# EAGLE design SparkFun GPS RTK Surveyor - Enclosure (EAGLE 9.5.2)

## Sheet 1 of 2
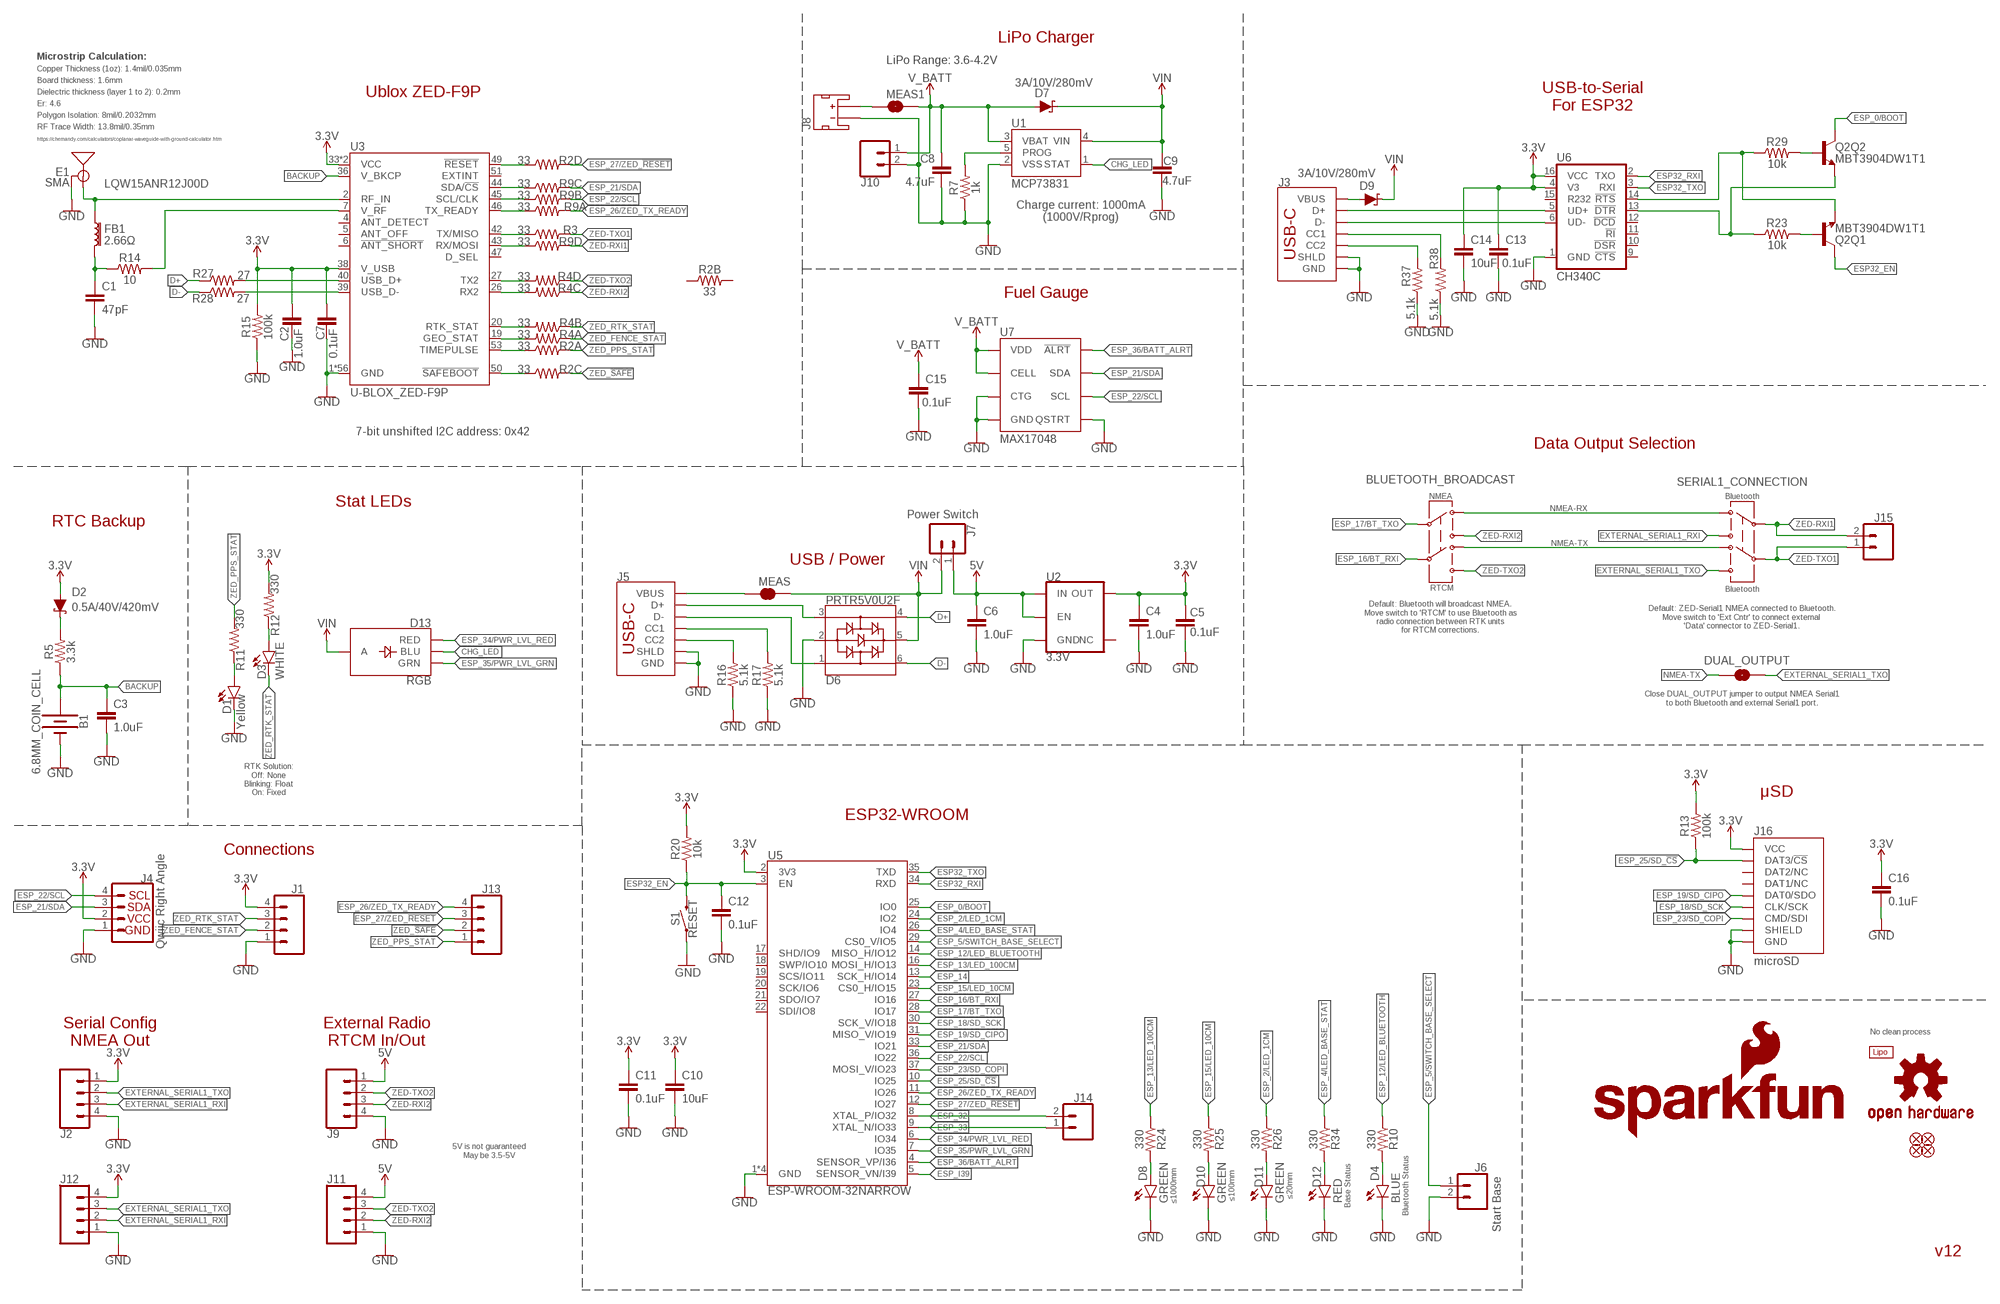
[diagram p0: schematic, sheet 1]

### Parts
B1  6.8MM_COIN_CELL  ML414H_IV01E_BATTERY  [ML414H_IV01E]
BLUETOOTH_BROADCAST  SWITCH-DPDT-SMD-AYZ0202  [SWITCH_DPDT_SMD_AYZ0202]
BT1  LIPO-OUTLINE1100  [LIPO-1000]
C1  47pF  47PF-0402-25V-5%-X7R  [0402]
C2  1.0uF  1.0UF-0603-16V-10%-X7R  [0603]
C3  1.0uF  1.0UF-0603-16V-10%-X7R  [0603]
C4  1.0uF  1.0UF-0603-16V-10%-X7R  [0603]
C5  0.1uF  0.1UF-0603-25V-5%  [0603]
C6  1.0uF  1.0UF-0603-16V-10%-X7R  [0603]
C7  0.1uF  0.1UF-0603-25V-5%  [0603]
C8  4.7uF  4.7UF-0603-35V-(20%)  [0603]
C9  4.7uF  4.7UF-0603-35V-(20%)  [0603]
C10  10uF  10UF-0603-6.3V-20%  [0603]
C11  0.1uF  0.1UF-0603-25V-(+80/-20%)  [0603]
C12  0.1uF  0.1UF-0603-25V-(+80/-20%)  [0603]
C13  0.1uF  0.1UF-0603-25V-(+80/-20%)  [0603]
C14  10uF  10UF-0603-6.3V-20%  [0603]
C15  0.1uF  0.1UF-0603-25V-(+80/-20%)  [0603]
C16  0.1uF  0.1UF-0603-25V-(+80/-20%)  [0603]
D1  Yellow  LED-YELLOW0603  [LED-0603]
D2  0.5A/40V/420mV  DIODE-SCHOTTKY-PMEG4005EJ  [SOD-323]
D3  WHITE  LED-WHITE0603  [LED-0603]
D4  BLUE  LED-BLUE0603  [LED-0603]
D6  PRTR5V0U2F  [SOT886]
D7  3A/10V/280mV  DIODE-SCHOTTKY-BAT60A  [SOD-323]
D8  GREEN  LED-GREEN0603  [LED-0603]
D9  3A/10V/280mV  DIODE-SCHOTTKY-BAT60A  [SOD-323]
D10  GREEN  LED-GREEN0603  [LED-0603]
D11  GREEN  LED-GREEN0603  [LED-0603]
D12  RED  LED-RED0603  [LED-0603]
D13  RGB  LED-RGB-CAPLCC  [P-LCC-4-3]
DUAL_OUTPUT  JUMPER-SMT_2_NO_SILK  [SMT-JUMPER_2_NO_SILK]
E1  SMA  ANTENNA-GROUNDEDEDGE_SMA_SMD  [SMA-EDGE-SMD]
FB1  2.66Ω  FERRITE_BEAD-0402-2.66OHM-1GHZ  [0402-TIGHT]
J1  CONN_041X04_NO_SILK_NO_POP  [1X04_NO_SILK]
J2  CONN_04JST-SMD-LOCKING  [JST-4-SMD-1.25MM-LOCKING]
J3  USB-C  USB_C_2-LAYER_PADS  [USB-C-16P-2LAYER-PADS]
J4  Qwiic Right Angle  I2C_STANDARDQWIIC  [JST04_1MM_RA]
J5  USB_C_2-LAYER_PADS  [USB-C-16P-2LAYER-PADS]
J6  Start Base  CONN_02-JST-2MM-SMT  [JST-2-SMD]
J7  Power Switch  CONN_02-JST-2MM-SMT  [JST-2-SMD]
J8  JST_2MM_MALE  [JST-2-SMD]
J9  CONN_04JST-SMD-LOCKING  [JST-4-SMD-1.25MM-LOCKING]
J10  CONN_021X02_NO_SILK  [1X02_NO_SILK]
J11  CONN_041X04_NO_SILK_NO_POP  [1X04_NO_SILK]
J12  CONN_041X04_NO_SILK_NO_POP  [1X04_NO_SILK]
J13  CONN_041X04_NO_SILK_NO_POP  [1X04_NO_SILK]
J14  CONN_021X02_NO_SILK  [1X02_NO_SILK]
J15  CONN_021X02_NO_SILK  [1X02_NO_SILK]
J16  microSD  MICRO-SD-SDIOPUSH-PUSH  [MICRO-SD-SOCKET]
JP21  FIDUCIALUFIDUCIAL  [FIDUCIAL-MICRO]
JP61  FIDUCIALUFIDUCIAL  [FIDUCIAL-MICRO]
JP71  FIDUCIALUFIDUCIAL  [FIDUCIAL-MICRO]
JP81  FIDUCIALUFIDUCIAL  [FIDUCIAL-MICRO]
LOGO1  OSHW-LOGOMINI  [OSHW-LOGO-MINI]
LOGO2  SFE_LOGO_NAME_FLAME.1_INCH  [SFE_LOGO_NAME_FLAME_.1]
MEAS  JUMPER-COMBO_2_NC_TRACE  [COMBO-JUMPER_2_NC_TRACE]
MEAS1  JUMPER-COMBO_2_NC_TRACE  [COMBO-JUMPER_2_NC_TRACE]
Q2  MBT3904DW1T1  TRANS_NPN_DUAL-MBT3904DW1T1  [SC70-6]
R2  33  33OHM_RA-1206-1/16W-5%  [1206_RA]
R3  33  33OHM-0603-1/10W-1%  [0603]
R4  33  33OHM_RA-1206-1/16W-5%  [1206_RA]
R5  3.3k  3.3KOHM-0603-1/10W-1%  [0603]
R7  1k  1KOHM-0603-1/10W-1%  [0603]
R9  33  33OHM_RA-1206-1/16W-5%  [1206_RA]
R10  330  330OHM-0603-1/10W-1%  [0603]
R11  330  330OHM-0603-1/10W-1%  [0603]
R12  330  330OHM-0603-1/10W-1%  [0603]
R13  100k  100KOHM-0603-1/10W-1%  [0603]
R14  10  10OHM-0603-1/10W-1%  [0603]
R15  100k  100KOHM-0603-1/10W-1%  [0603]
R16  5.1k  5.1KOHM5.1KOHM-0603-1/10W-1%  [0603]
R17  5.1k  5.1KOHM5.1KOHM-0603-1/10W-1%  [0603]
R20  10k  10KOHM-0603-1/10W-1%  [0603]
R23  10k  10KOHM-0603-1/10W-1%  [0603]
R24  330  330OHM-0603-1/10W-1%  [0603]
R25  330  330OHM-0603-1/10W-1%  [0603]
R26  330  330OHM-0603-1/10W-1%  [0603]
R27  27  27OHM-0603-1/10W-1%  [0603]
R28  27  27OHM-0603-1/10W-1%  [0603]
R29  10k  10KOHM-0603-1/10W-1%  [0603]
R34  330  330OHM-0603-1/10W-1%  [0603]
R37  5.1k  5.1KOHM5.1KOHM-0603-1/10W-1%  [0603]
R38  5.1k  5.1KOHM5.1KOHM-0603-1/10W-1%  [0603]
S1  RESET  MOMENTARY-SWITCH-SPST-SMD-5.2-TALL-REDUNDANT  [TACTILE_SWITCH_SMD_5.2MM]
SERIAL1_CONNECTION  SWITCH-DPDT-SMD-AYZ0202  [SWITCH_DPDT_SMD_AYZ0202]
U1  MCP73831  [SOT23-5]
U2  3.3V  V_REG_AP2112K-3.3V  [SOT23-5]
U3  U-BLOX_ZED-F9P  [ZED-F9P]
U5  ESP-WROOM-32NARROW  [ESP-WROOM-32-NARROW]
U6  CH340C  [SO016]
U7  MAX17048  MAX17048DFN8  [DFN-8]

### Nets
3.3V [power]: C2.1 C4.1 C5.2 C7.2 C10.1 C11.1 C13.1 C14.1 C16.1 D2.A J1.4 J2.1 J4.2 J12.4 J16.VCC R12.2 R13.2 R15.2 R20.2 U2.5(OUT) U3.33(VCC) U3.34(VCC) U3.38(V_USB) U5.2(3V3) U6.4(V3) U6.16(VCC)
5V [power]: C6.1 J7.1 J9.1 J11.4 U2.1(IN) U2.3(EN)
ANT_VCC: C1.1 FB1.2 R14.1
BACKUP: B1.+ C3.1 R5.1 U3.36(V_BKCP)
CC1: J5.A5(CC1) R17.2
CC2: J5.B5(CC2) R16.2
CC3: J3.B5(CC2) R37.2
CC4: J3.A5(CC1) R38.2
CHG_LED: D13.3(BLU) U1.1(STAT)
D+: D6.4 R27.1
D+1: J3.A6(D+) J3.B6(D+) U6.5(UD+)
D-: D6.6 R28.1
D-1: J3.A7(D-) J3.B7(D-) U6.6(UD-)
ESP32_!DTR: Q2.1(Q2:E) R23.1 U6.13(!DTR)
ESP32_!RTS: Q2.4(Q1:E) R29.1 U6.14(!RTS)
ESP32_EN: C12.1 Q2.3(Q1:C) R20.1 S1.3 S1.4 U5.3(EN)
ESP32_RXI: U5.34(RXD) U6.2(TXO)
ESP32_TXO: U5.35(TXD) U6.3(RXI)
ESP_0/BOOT: Q2.6(Q2:C) U5.25(IO0)
ESP_2/LED_1CM: R26.1 U5.24(IO2)
ESP_4/LED_BASE_STAT: R34.1 U5.26(IO4)
ESP_5/SWITCH_BASE_SELECT: J6.1 U5.29(CS0_V/IO5)
ESP_12/LED_BLUETOOTH: R10.1 U5.14(MISO_H/IO12)
ESP_13/LED_100CM: R24.1 U5.16(MOSI_H/IO13)
ESP_14: U5.13(SCK_H/IO14)
ESP_15/LED_10CM: R25.1 U5.23(CS0_H/IO15)
ESP_16/BT_RXI: BLUETOOTH_BROADCAST.5 U5.27(IO16)
ESP_17/BT_TXO: BLUETOOTH_BROADCAST.2 U5.28(IO17)
ESP_18/SD_SCK: J16.SCLK(CLK/SCK) U5.30(SCK_V/IO18)
ESP_19/SD_CIPO: J16.DO/DAT0(DAT0/SDO) U5.31(MISO_V/IO19)
ESP_21/SDA: J4.3 R9.P6 U5.33(IO21) U7.8(SDA)
ESP_22/SCL: J4.4 R9.P7 U5.36(IO22) U7.7(SCL)
ESP_23/SD_COPI: J16.DI/CMD(CMD/SDI) U5.37(MOSI_V/IO23)
ESP_25/SD_!CS!: J16.CS/DAT3(DAT3/!CS!) R13.1 U5.10(IO25)
ESP_26/ZED_TX_READY: J13.4 R9.P8 U5.11(IO26)
ESP_27/ZED_!RESET!: J13.3 R2.P5 U5.12(IO27)
ESP_32: J14.2 U5.8(XTAL_P/IO32)
ESP_33: J14.1 U5.9(XTAL_N/IO33)
ESP_34/PWR_LVL_RED: D13.1(RED) U5.6(IO34)
ESP_35/PWR_LVL_GRN: D13.2(GRN) U5.7(IO35)
ESP_36/BATT_ALRT: U5.4(SENSOR_VP/I36) U7.5(!ALRT)
ESP_I39: U5.5(SENSOR_VN/I39)
EXTERNAL_SERIAL1_RXI: J2.3 J12.2 SERIAL1_CONNECTION.3
EXTERNAL_SERIAL1_TXO: DUAL_OUTPUT.2 J2.2 J12.3 SERIAL1_CONNECTION.6
FENCE_LV: R4.P8 U3.19(GEO_STAT)
GND: B1.- C1.2 C2.2 C3.2 C4.2 C5.1 C6.2 C7.1 C8.2 C9.2 C10.2 C11.2 C12.2 C13.2 C14.2 C15.2 C16.2 D1.C D4.C D6.2 D8.C D10.C D11.C D12.C E1.GND@0(GND) E1.GND@1(GND) J1.1 J2.4 J3.GND J3.GND2(GND) J3.SHLD1(SHLD) J3.SHLD2(SHLD) J3.SHLD3(SHLD) J3.SHLD4(SHLD) J4.1 J5.GND J5.GND2(GND) J5.SHLD1(SHLD) J5.SHLD2(SHLD) J5.SHLD3(SHLD) J5.SHLD4(SHLD) J6.2 J8.1(-) J9.4 J10.2 J11.1 J12.1 J16.CD1(SHIELD) J16.GND J16.GND1(GND) J16.GND3(GND) R7.1 R15.1 R16.1 R17.1 R37.1 R38.1 S1.1 S1.2 U1.2(VSS) U2.2(GND) U3.1(GND) U3.3(GND) U3.12(GND) U3.14(GND) U3.32(GND) U3.37(GND) U3.41(GND) U3.48(GND) U3.55(GND) U3.56(GND) U3.57(GND) U3.58(GND) U3.59(GND) U3.60(GND) U3.61(GND) U3.62(GND) U3.63(GND) U3.64(GND) U3.65(GND) U3.66(GND) U3.67(GND) U3.68(GND) U3.69(GND) U3.70(GND) U3.71(GND) U3.72(GND) U3.73(GND) U3.74(GND) U3.75(GND) U3.76(GND) U3.77(GND) U3.78(GND) U3.79(GND) U3.80(GND) U3.81(GND) U3.82(GND) U3.83(GND) U3.84(GND) U3.85(GND) U3.86(GND) U3.87(GND) U3.88(GND) U3.89(GND) U3.90(GND) U3.91(GND) U3.92(GND) U3.93(GND) U3.94(GND) U3.95(GND) U3.96(GND) U3.97(GND) U3.98(GND) U3.99(GND) U3.100(GND) U3.101(GND) U3.102(GND) U5.1(GND) U5.15(GND) U5.38(GND) U5.GND U6.1(GND) U7.1(CTG) U7.4(GND) U7.6(QSTRT) U7.9(GND)
GPS_ANT1 [RF]: E1.SIG(SIGNAL) FB1.1 U3.2(RF_IN)
N$1: D3.A R12.1
N$2: D1.A R11.1
N$3: D4.A R10.2
N$4 [power]: J5.VBUS1(VBUS) J5.VBUS2(VBUS) MEAS.1 MEAS.3
N$5: R7.2 U1.5(PROG)
N$6: D2.C R5.2
N$7: J8.2(+) MEAS1.1 MEAS1.3
N$11: R27.2 U3.40(USB_D+)
N$12: R28.2 U3.39(USB_D-)
N$13: R14.2 U3.7(V_RF)
N$16: R2.P4 U3.49(!RESET!)
N$18: R2.P3 U3.50(!SAFEBOOT!)
N$22: R9.P1 U3.46(TX_READY)
N$24: Q2.5(Q1:B) R23.2
N$25: Q2.2(Q2:B) R29.2
N$26: D8.A R24.2
N$27: D10.A R25.2
N$29: D11.A R26.2
N$30: D12.A R34.2
N$32 [power]: D9.A J3.VBUS1(VBUS) J3.VBUS2(VBUS)
NMEA-RX: BLUETOOTH_BROADCAST.1 SERIAL1_CONNECTION.1
NMEA-TX: BLUETOOTH_BROADCAST.4 DUAL_OUTPUT.1 SERIAL1_CONNECTION.4
PPS: R2.P1 U3.53(TIMEPULSE)
RTK_LV: R4.P7 U3.20(RTK_STAT)
RX2_LV: R4.P6 U3.26(RX2)
RXLV: R9.P4 U3.43(RX/MOSI)
SCL_LV: R9.P2 U3.45(SCL/CLK)
SDA_LV: R9.P3 U3.44(SDA/!CS!)
TX2_LV: R4.P5 U3.27(TX2)
TXLV: R3.1 U3.42(TX/MISO)
UNP_D+: D6.3 J5.A6(D+) J5.B6(D+)
UNP_D-: D6.1 J5.A7(D-) J5.B7(D-)
V_BATT [power]: C8.1 C15.1 D7.A J10.1 MEAS1.2 MEAS1.4 U1.3(VBAT) U7.2(CELL) U7.3(VDD)
VIN [power]: C9.1 D6.5 D7.C D9.C D13.4(A) J7.2 MEAS.2 MEAS.4 U1.4(VIN)
ZED-RXI1: J15.2 R9.P5 SERIAL1_CONNECTION.2
ZED-RXI2: BLUETOOTH_BROADCAST.3 J9.3 J11.2 R4.P3
ZED-TXO1: J15.1 R3.2 SERIAL1_CONNECTION.5
ZED-TXO2: BLUETOOTH_BROADCAST.6 J9.2 J11.3 R4.P4
ZED_!SAFE!: J13.2 R2.P6
ZED_FENCE_STAT: J1.2 R4.P1
ZED_PPS_STAT: J13.1 R2.P8 R11.2
ZED_RTK_STAT: D3.C J1.3 R4.P2
Unconnected: J8.NC1(PAD1) J8.NC2(PAD2) J16.DAT1(DAT1/NC) J16.DAT2(DAT2/NC) R2.P2 R2.P7 U2.4(NC) U3.4(ANT_DETECT) U3.5(ANT_OFF) U3.6(!ANT_SHORT!) U3.47(D_SEL) U3.51(EXTINT) U5.17(SHD/IO9) U5.18(SWP/IO10) U5.19(SCS/IO11) U5.20(SCK/IO6) U5.21(SDO/IO7) U5.22(SDI/IO8) U6.9(!CTS) U6.10(!DSR) U6.11(!RI) U6.12(!DCD) U6.15(R232)

### Notes on the sheet
- LiPo Charger
- Microstrip Calculation: | LiPo Range: 3.6-4.2V
- Copper Thickness (1oz): 1.4mil/0.035mm
- Board thickness: 1.6mm
- Ublox ZED-F9P
- Dielectric thickness (layer 1 to 2): 0.2mm
- USB-to-Serial
  For ESP32
- Er: 4.6
- Polygon Isolation: 8mil/0.2032mm
- RF Trace Width: 13.8mil/0.35mm
- https://chemandy.com/calculators/coplanar-waveguide-with-ground-calculator.htm
- LQW15ANR12J00D
- Charge current: 1000mA
  (1000V/Rprog)
- Fuel Gauge
- 7-bit unshifted I2C address: 0x42
- Data Output Selection
- NMEA | Bluetooth
- Stat LEDs
- RTC Backup
- USB / Power
- RTCM | Bluetooth
- Default: Bluetooth will broadcast NMEA.
  Move switch to 'RTCM' to use Bluetooth as
  radio connection between RTK units
  for RTCM corrections.
- Default: ZED-Serial1 NMEA connected to Bluetooth.
  Move switch to 'Ext Cntr' to connect external 
  'Data' connector to ZED-Serial1.
- Close DUAL_OUTPUT jumper to output NMEA Serial1
  to both Bluetooth and external Serial1 port.
- RTK Solution:
  Off: None
  Blinking: Float
  On: Fixed
- μSD
- ESP32-WROOM
- Connections
- Serial Config
  NMEA Out
- External Radio
  RTCM In/Out
- No clean process
- 5V is not guaranteed
  May be 3.5-5V
- ≤1000mm | ≤100mm | ≤20mm | Base Status | Bluetooth Status
- v12

## Sheet 2 of 2

## Library data of the parts
B1 = SparkFun-Batteries:ML414H_IV01E_BATTERY: SEIKO ML414H-IV01E Reflowable Lithium Battery ML414H is a rechargeable, coin type battery with features such as Pb-free reflowable (Peak temperature: 260 C) and high temperature heat resistance. Battery Characteristics: 3.1V max voltage Voff is 2V 1mAH 3k series resistor with battery 72 hour charge time from 2.0-3.1V 2.3-2.8V initial charge; PROD_ID: BATT-14267
BLUETOOTH_BROADCAST SERIAL1_CONNECTION = SparkFun-Switches:SWITCH-DPDT: Double-Pole, Double-Throw (DPDT) Switch Double-pole, double-throw switches. Variant Overview PTH-GPI-152-3013 Used on SparkFun Geiger Counter <https://www.sparkfun.com/products/11345> SMD-AY0202 Surface Mount DPDT Switch <https://www.sparkfun.com/products/597> (COM-00597) Used on e.g. LilyPad Arduino USB - ATmega32U4 Board <https://www.sparkfun.com/products/12049>; PROD_ID: SWCH-08179; SF_SKU: COM-00597
BT1 = SparkFun-Batteries:LIPO-OUTLINE: LiPo Battery Outlines Outlines for common LiPo batteries sold by SparkFun. (Note: no terminals or connection points, just the dimensions.) SparkFun Products Polymer Lithium Ion Battery - 110mAh <https://www.sparkfun.com/products/13853> (PRT-13853) Polymer Lithium Ion Battery - 1000mAh <https://www.sparkfun.com/products/13813> (PRT-13813) Polymer Lithium Ion Battery - 2000mAh <https://www.sparkfun.com/products/8483> (PRT-08483); PROD_ID: BATT-13243; SF_SKU: PRT-13813
C1 = SparkFun-Capacitors:47PF: 47pF ceramic capacitors A capacitor is a passive two-terminal electrical component used to store electrical energy temporarily in an electric field.; PROD_ID: CAP-15063
C2-C4 C6 = SparkFun-Capacitors:1.0UF: 1µF ceramic capacitors A capacitor is a passive two-terminal electrical component used to store electrical energy temporarily in an electric field.; PROD_ID: CAP-13930
C5 C7 = SparkFun-Capacitors:0.1UF: 0.1µF ceramic capacitors A capacitor is a passive two-terminal electrical component used to store electrical energy temporarily in an electric field.; PROD_ID: CAP-08604
C8 C9 = SparkFun-Capacitors:4.7UF: 4.7µF ceramic capacitors A capacitor is a passive two-terminal electrical component used to store electrical energy temporarily in an electric field.; PROD_ID: CAP-14106
C10 C14 = SparkFun-Capacitors:10UF: 10.0µF ceramic capacitors A capacitor is a passive two-terminal electrical component used to store electrical energy temporarily in an electric field.; PROD_ID: CAP-11015
C11-C13 C15 C16 = SparkFun-Capacitors:0.1UF: 0.1µF ceramic capacitors A capacitor is a passive two-terminal electrical component used to store electrical energy temporarily in an electric field.; PROD_ID: CAP-00810
D1 = SparkFun-LED:LED-YELLOW: Yellow SMD LED Used in manufacturing several products at SparkFun. Packages: 0603 - SMD 0603 package[Product Link] <http://www.kingbrightusa.com/product.asp?catalog_name=LED&product_id=APT1608SYCK> 0603 -SMART - SMART SMD 0603 package (more efficient/more expensive) [Product Link] <http://www.osram-os.com/osram_os/en/products/product-catalog/led-light-emitting-diodes/smartled-0603/ly-l29k/index.jsp> LilyPad - SMD1206 package[Product Datasheet] <https://www.sparkfun.com/datasheets/DevTools/LilyPad/Q150YUS4.pdf> SparkFun Products: Blynk Board <https://www.sparkfun.com/products/13794> IOIO-OTG <https://www.sparkfun.com/products/13613> XBee Explorer Serial <https://www.sparkfun.com/products/13225>; PROD_ID: DIO-09003
D2 = SparkFun-DiscreteSemi:DIODE-SCHOTTKY: Schottky diode A Schottky diode is a semiconductor diode which has a low forward voltage drop and a very fast switching action.; PROD_ID: DIO-10955
D3 = SparkFun-LED:LED-WHITE: White SMD LED Used in manufacturing several products at SparkFun. Packages: 0603 - Bright White SMD 0603 package[Product Link] <http://www.kingbrightusa.com/product.asp?catalog_name=LED&product_id=APT1608QWF/D> 1206 - Bright White SMD1206 package [Product Link] <http://www.kingbrightusa.com/product.asp?catalog_name=LED&product_id=APT3216QWF/D> 3014 - Super Bright SMD 3014 package [Datasheet] <http://www.lumileds.com/uploads/459/DS208-pdf> SparkFun Products: Blackberry Trackballer Breakout <https://www.sparkfun.com/products/13169> Digital SandBox <https://www.sparkfun.com/products/12651>; PROD_ID: DIO-09004
D4 = SparkFun-LED:LED-BLUE: Blue SMD LED Used in manufacturing of various products at SparkFun Packages: 0603 - SMD 0603 package [Product Link] <http://www.digikey.com/product-detail/en/SMLE12BC7TT86/511-1589-2-ND/1641808> 1206 - SMD1206 package [Product Link] <http://www.digikey.com/product-detail/en/lite-on-inc/LTST-C150TBKT/160-1643-1-ND/573584> SparkFun Products: ESP8266 Thing-Dev Board <https://www.sparkfun.com/products/13711> RedBoard <https://www.sparkfun.com/products/12757>; PROD_ID: DIO-08575
D6 = SparkFun-IC-Power:PRTR5V0U2: A small ESD protection device. Most commonly used on USB D+/D- signals to protect large, expensive, or especially sensitive USB enabled devices.; PROD_ID: DIO-14084
D7 D9 = SparkFun-DiscreteSemi:DIODE-SCHOTTKY: Schottky diode A Schottky diode is a semiconductor diode which has a low forward voltage drop and a very fast switching action.; PROD_ID: DIO-14072
D8 D10 D11 = SparkFun-LED:LED-GREEN: Green SMD LED Used in manufacturing of various products at SparkFun Packages: 0603 - SMD 0603 package [Product Link] <http://www.futureelectronics.com/en/technologies/semiconductors/optoelectronics/leds/Pages/9894312-LTST-C190GKT.aspx?CrossPart=HSMG-C190&IM=0> LilyPad 1206 - SMD1206 LilyPad package [Product Link] <http://www.futureelectronics.com/en/Technologies/Product.aspx?ProductID=IN150NGHARVATEKCORPORATION2049943&IM=0> 1206 - SMD1206 package [Product Link] <http://www.futureelectronics.com/en/technologies/semiconductors/optoelectronics/leds/Pages/8315665-LTST-C150KGKT.aspx?IM=0> 1206 Bottom Mount -SMD 1206 Bottom Mount [Product Link] <http://www.digikey.com/product-detail/en/lite-on-inc/LTST-C230KGKT/160-1456-1-ND/386854> SparkFun Products: Pro Mini 328 -5V <https://www.sparkfun.com/products/821> RedBoard <https://www.sparkfun.com/products/12757> MP3 Trigger <https://www.sparkfun.com/products/13720> Makey Makey <https://www.sparkfun.com/products/11076>; PROD_ID: DIO-00821
D12 = SparkFun-LED:LED-RED: Red SMD LED Used in manufacturing of most products at SparkFun Packages: 0603 - SMD 0603 package [Product Link] <http://docs.avagotech.com/docs/AV02-0551EN> 0603 SMART - SMD 0603 SMART package ( more efficient and expensive)[Product Link] <http://www.osram-os.com/Graphics/XPic2/00077099_0.pdf> 1206 - SMD1206 package [Product Link] <https://www.sparkfun.com/datasheets/DevTools/LilyPad/Q150OVS4.pdff> SparkFun Products: Pro Mini 328 -5V <https://www.sparkfun.com/products/821> RedBoard <https://www.sparkfun.com/products/12757> IOIO-OTG <https://www.sparkfun.com/products/13613>; PROD_ID: DIO-00819
D13 = SparkFun-LED:LED-RGB-CA: LED-RGB Diffused Common Anode Packages: LED RGB-THRU P-LCC-4-3 LED-TRICOLOR-SMD SparkFun Products: RGB Diffused Common Anode- Diffuse <[https://www.sparkfun.com/products/10821]> RGB Diffused Common Anode - Clear <[https://www.sparkfun.com/products/10820]> Qduino Mini <[https://www.sparkfun.com/products/13614]> Triple Output LED RGB - SMD <https://www.sparkfun.com/products/7844>; PROD_ID: DIO-12986
DUAL_OUTPUT = SparkFun-Jumpers:JUMPER-SMT_2_NO: Normally open jumper This jumper has two pads in close proximity to each other. Apply solder to close the connection. Round pads are easier to solder for beginners, but are a lot larger. SparkFun Product that uses the round pads: SparkFun EL Sequencer <https://www.sparkfun.com/products/12781>
E1 = SparkFun-RF:ANTENNA-GROUNDED: Antenna w/ Ground Connection 2.4GHz antennae with signal and ground terminals. TRACE_ANTENNA_2.4GHZ_15.2MM - Meander Trace antenna 15.2 x 5.7mm footprint Based on layout from TI app note AN043 <http://www.ti.com/lit/an/swra117d/swra117d.pdf>. TRACE_ANTENNA_2.4GHZ_25.7MM - Inverted F trace antenna 25.7 x 7.5 mm footprint. Based on layout from TI design note DN0007 <http://www.ti.com/lit/an/swru120b/swru120b.pdf>.; PROD_ID: CONN-15100
FB1 = SparkFun-Coils:FERRITE_BEAD: Ferrite Bead (blocks, cores, rings, chokes, etc.) Inductor with layers of ferrite used to suppress high frequencies. Often used to isolate high frequency noise. SparkFun Products: IOIO-OTG - V2.2 <https://www.sparkfun.com/products/13613> SparkFun SAMD21 Mini Breakout <https://www.sparkfun.com/products/13664> SparkFun 6 Degrees of Freedom Breakout - LSM6DS3 <https://www.sparkfun.com/products/13339> SparkFun SAMD21 Dev Breakout <https://www.sparkfun.com/products/13672>; PROD_ID: NDUC-15072
J1 J11-J13 = SparkFun-Connectors:CONN_04: Multi connection point. Often used as Generic Header-pin footprint for 0.1 inch spaced/style header connections On any of the 0.1 inch spaced packages, you can populate with these: Break Away Headers - Straight <https://www.sparkfun.com/products/116> (PRT-00116) Break Away Male Headers - Right Angle <https://www.sparkfun.com/products/553> (PRT-00553) Female Headers <https://www.sparkfun.com/products/115> (PRT-00115) Break Away Headers - Machine Pin <https://www.sparkfun.com/products/117> (PRT-00117) Break Away Female Headers - Swiss Machine Pin <https://www.sparkfun.com/products/743> (PRT-00743) For SCREWTERMINALS and SPRING TERMINALS visit here: Screw Terimnals on SparkFun.com <https://www.sparkfun.com/search/results?term=Screw+Terminals> (5mm/3.5mm/2.54mm spacing) This device is also useful as a general connection point to wire up your design to another part of your project. Our various solder wires solder well into these plated through hole pads. Hook-Up Wire - Assortment (Stranded, 22 AWG) <https://www.sparkfun.com/products/11375> (PRT-11375) Hook-Up Wire - Assortment (Solid Core, 22 AWG) <https://www.sparkfun.com/products/11367> (PRT-11367) View the entire wire category on our website here <https://www.sparkfun.com/categories/141> Special notes: Molex polarized connector foot print use with SKU : PRT-08231 with associated crimp pins and housings. 1MM SMD Version SKU: PRT-10208
J2 J9 = SparkFun-Connectors:CONN_04: Multi connection point. Often used as Generic Header-pin footprint for 0.1 inch spaced/style header connections On any of the 0.1 inch spaced packages, you can populate with these: Break Away Headers - Straight <https://www.sparkfun.com/products/116> (PRT-00116) Break Away Male Headers - Right Angle <https://www.sparkfun.com/products/553> (PRT-00553) Female Headers <https://www.sparkfun.com/products/115> (PRT-00115) Break Away Headers - Machine Pin <https://www.sparkfun.com/products/117> (PRT-00117) Break Away Female Headers - Swiss Machine Pin <https://www.sparkfun.com/products/743> (PRT-00743) For SCREWTERMINALS and SPRING TERMINALS visit here: Screw Terimnals on SparkFun.com <https://www.sparkfun.com/search/results?term=Screw+Terminals> (5mm/3.5mm/2.54mm spacing) This device is also useful as a general connection point to wire up your design to another part of your project. Our various solder wires solder well into these plated through hole pads. Hook-Up Wire - Assortment (Stranded, 22 AWG) <https://www.sparkfun.com/products/11375> (PRT-11375) Hook-Up Wire - Assortment (Solid Core, 22 AWG) <https://www.sparkfun.com/products/11367> (PRT-11367) View the entire wire category on our website here <https://www.sparkfun.com/categories/141> Special notes: Molex polarized connector foot print use with SKU : PRT-08231 with associated crimp pins and housings. 1MM SMD Version SKU: PRT-10208; PROD_ID: CONN-15303
J3 J5 = SparkFun-Connectors:USB_C: USB Type C 16Pin Connector Super Speed pins not available on the 16-pin purely SMD connector so this part is best for USB 2.0 implementations. D1 and D2 are tied together enabling D+/- no matter which way the cable is plugged into the connector. The two channel configuration pins (CC1/2) are exposed. These are normally connected to ground via 5.1k resistors but can be reconfigured for high current/high power applications.; PROD_ID: CONN-14122
J4 = SparkFun-Connectors:I2C_STANDARD: SparkFun I2C Standard Pinout Header SparkFun has standardized on a pinout for all I2C based sensor breakouts. This pinout allows I2C boards to be plugged directly into the headers on Arduino Uno compatible boards, and to be daisy chained easily. Example SparkFun Products: SparkFun Atmospheric Sensor Breakout - BME280 <https://www.sparkfun.com/products/13676> SparkFun Altitude/Pressure Sensor Breakout - MPL3115A2 <https://www.sparkfun.com/products/11084> SparkFun TOF Range Finder Sensor - VL6180 <https://www.sparkfun.com/products/12785>; PROD_ID: CONN-13694
J6 J7 = SparkFun-Connectors:CONN_02: Multi connection point. Often used as Generic Header-pin footprint for 0.1 inch spaced/style header connections On any of the 0.1 inch spaced packages, you can populate with these: Break Away Headers - Straight <https://www.sparkfun.com/products/116> (PRT-00116) Break Away Male Headers - Right Angle <https://www.sparkfun.com/products/553> (PRT-00553) Female Headers <https://www.sparkfun.com/products/115> (PRT-00115) Break Away Headers - Machine Pin <https://www.sparkfun.com/products/117> (PRT-00117) Break Away Female Headers - Swiss Machine Pin <https://www.sparkfun.com/products/743> (PRT-00743) For SCREWTERMINALS and SPRING TERMINALS visit here: Screw Terimnals on SparkFun.com <https://www.sparkfun.com/search/results?term=Screw+Terminals> (5mm/3.5mm/2.54mm spacing) This device is also useful as a general connection point to wire up your design to another part of your project. Our various solder wires solder well into these plated through hole pads. Hook-Up Wire - Assortment (Stranded, 22 AWG) <https://www.sparkfun.com/products/11375> (PRT-11375) Hook-Up Wire - Assortment (Solid Core, 22 AWG) <https://www.sparkfun.com/products/11367> (PRT-11367) View the entire wire category on our website here <https://www.sparkfun.com/categories/141> Special notes: Molex polarized connector foot print use with: PRT-08233 with associated crimp pins and housings. 2.54_SCREWTERM for use with PRT-10571. 3.5mm Screw Terminal footprints for PRT-08084 5mm Screw Terminal footprints for use with PRT-08432; PROD_ID: CONN-11443
J8 = SparkFun-Connectors:JST_2MM_MALE: JST 2MM MALE RA CONNECTOR Two pin, compact surface mount connector. Commonly used as a battery input connection point. We really like the solid locking feeling and high current rating on these small connectors. We use these all the time as battery connectors. Mates to single-cell LiPo batteries. Here is the connector we sell at SparkFun: JST Right Angle Connector - White <https://www.sparkfun.com/products/8612> (PRT-08612) Datasheet <http://www.sparkfun.com/datasheets/Prototyping/Connectors/JST-Horizontal.pdf> It was used on these SparkFun products: SparkFun MOSFET Power Controller <https://www.sparkfun.com/products/11214> (PRT-11214) SparkFun Battery Babysitter - LiPo Battery Manager <https://www.sparkfun.com/products/13777> (PRT-13777) And many, many others that required a lipo battery connection.; PROD_ID: CONN-11443; SF_ID: PRT-08612
J10 J14 J15 = SparkFun-Connectors:CONN_02: Multi connection point. Often used as Generic Header-pin footprint for 0.1 inch spaced/style header connections On any of the 0.1 inch spaced packages, you can populate with these: Break Away Headers - Straight <https://www.sparkfun.com/products/116> (PRT-00116) Break Away Male Headers - Right Angle <https://www.sparkfun.com/products/553> (PRT-00553) Female Headers <https://www.sparkfun.com/products/115> (PRT-00115) Break Away Headers - Machine Pin <https://www.sparkfun.com/products/117> (PRT-00117) Break Away Female Headers - Swiss Machine Pin <https://www.sparkfun.com/products/743> (PRT-00743) For SCREWTERMINALS and SPRING TERMINALS visit here: Screw Terimnals on SparkFun.com <https://www.sparkfun.com/search/results?term=Screw+Terminals> (5mm/3.5mm/2.54mm spacing) This device is also useful as a general connection point to wire up your design to another part of your project. Our various solder wires solder well into these plated through hole pads. Hook-Up Wire - Assortment (Stranded, 22 AWG) <https://www.sparkfun.com/products/11375> (PRT-11375) Hook-Up Wire - Assortment (Solid Core, 22 AWG) <https://www.sparkfun.com/products/11367> (PRT-11367) View the entire wire category on our website here <https://www.sparkfun.com/categories/141> Special notes: Molex polarized connector foot print use with: PRT-08233 with associated crimp pins and housings. 2.54_SCREWTERM for use with PRT-10571. 3.5mm Screw Terminal footprints for PRT-08084 5mm Screw Terminal footprints for use with PRT-08432
J16 = SparkFun-Connectors:MICRO-SD-SDIO: microSD Socket for Transflash Push-push type µSD socket. tDoc lines correctly indicate media card edge positions when inserting (unlocked, locked, depressed). NOTE: CD1 and CD2 are connected internally, and the default detect state of the socket is detect pin to ground. SparkFun Products: WAV Trigger <https://www.sparkfun.com/products/13660> CAN-Bus Shield <https://www.sparkfun.com/products/13262> SparkFun Level Shifing microSD Breakout <https://www.sparkfun.com/products/13743>; PROD_ID: CONN-07820
JP21 JP61 JP71 JP81 = SparkFun-Aesthetics:FIDUCIAL: Fiducial Alignment Points Point-of-reference for pick-and-place machines and other optical instruments.
LOGO1 = SparkFun-Aesthetics:OSHW-LOGO: Open-Source Hardware (OSHW) Logo This logo indicates the piece of hardware it is found on incorporates a OSHW license and/or adheres to the definition of open source hardware found here: http://freedomdefined.org/OSHW
LOGO2 = SparkFun-Aesthetics:SFE_LOGO_NAME_FLAME: SparkFun Font Logo w/ Flame This is the SparkFun full logo. The logo on the schematic will always be the same size; the package variant is the height of the flame part of the logo. Default layer for the logo on the board is tSilk.
MEAS MEAS1 = SparkFun-Jumpers:JUMPER-COMBO_2_NC_TRACE
Q2 = SparkFun-DiscreteSemi:TRANS_NPN_DUAL: Dual NPN Transistors in Single Package The MBT3904W1 puts two general purpose 3904 NPN transistors in a single package. Datasheet <http://www.onsemi.com/pub_link/Collateral/MBT3904DW1T1-D.PDF> SparkFun Products: SparkFun ESP32 Thing <https://www.sparkfun.com/products/13907>; PROD_ID: TRANS-13337
R2 R4 R9 = SparkFun-Resistors:33OHM_RA: EXB-38V330JV Four Resistory Array - AEC-Q200 Certified; PROD_ID: RES-15081
R3 = SparkFun-Resistors:33OHM: 33Ω resistor A resistor is a passive two-terminal electrical component that implements electrical resistance as a circuit element. Resistors act to reduce current flow, and, at the same time, act to lower voltage levels within circuits. - Wikipedia; PROD_ID: RES-08270
R5 = SparkFun-Resistors:3.3KOHM: 3.3kΩ resistor A resistor is a passive two-terminal electrical component that implements electrical resistance as a circuit element. Resistors act to reduce current flow, and, at the same time, act to lower voltage levels within circuits. - Wikipedia; PROD_ID: RES-07851
R7 = SparkFun-Resistors:1KOHM: 1kΩ resistor A resistor is a passive two-terminal electrical component that implements electrical resistance as a circuit element. Resistors act to reduce current flow, and, at the same time, act to lower voltage levels within circuits. - Wikipedia; PROD_ID: RES-07856
R10-R12 R24-R26 R34 = SparkFun-Resistors:330OHM: 330Ω resistor A resistor is a passive two-terminal electrical component that implements electrical resistance as a circuit element. Resistors act to reduce current flow, and, at the same time, act to lower voltage levels within circuits. - Wikipedia; PROD_ID: RES-00818
R13 R15 = SparkFun-Resistors:100KOHM: 100kΩ resistor A resistor is a passive two-terminal electrical component that implements electrical resistance as a circuit element. Resistors act to reduce current flow, and, at the same time, act to lower voltage levels within circuits. - Wikipedia; PROD_ID: RES-07828
R14 = SparkFun-Resistors:10OHM: 10Ω resistor A resistor is a passive two-terminal electrical component that implements electrical resistance as a circuit element. Resistors act to reduce current flow, and, at the same time, act to lower voltage levels within circuits. - Wikipedia; PROD_ID: RES-12581
R16 R17 R37 R38 = SparkFun-Resistors:5.1KOHM; PROD_ID: RES-12083
R20 R23 R29 = SparkFun-Resistors:10KOHM: 10kΩ resistor A resistor is a passive two-terminal electrical component that implements electrical resistance as a circuit element. Resistors act to reduce current flow, and, at the same time, act to lower voltage levels within circuits. - Wikipedia; PROD_ID: RES-00824
R27 R28 = SparkFun-Resistors:27OHM: 27Ω resistor A resistor is a passive two-terminal electrical component that implements electrical resistance as a circuit element. Resistors act to reduce current flow, and, at the same time, act to lower voltage levels within circuits. - Wikipedia; PROD_ID: RES-09334
S1 = SparkFun-Switches:MOMENTARY-SWITCH-SPST: Momentary Switch (Pushbutton) - SPST Normally-open (NO) SPST momentary switches (buttons, pushbuttons). Variants PTH-12MM - 12mm square, through-hole Momentary Pushbutton Switch - 12mm Square <https://www.sparkfun.com/products/9190> (COM-09190) PTH-6.0MM, PTH-6.0MM-KIT - 6.0mm square, through-hole Mini Pushbutton Switch <https://www.sparkfun.com/products/97> (COM-00097) KIT package intended for soldering kit's - only one side of pads' copper is exposed. PTH-RIGHT-ANGLE-KIT - Right-angle, through-hole Right Angle Tactile Button <https://www.sparkfun.com/products/10791> - Used on SparkFun BigTime Watch Kit <https://www.sparkfun.com/products/11734> SMD-12MM - 12mm square, surface-mount Tactile Button - SMD (12mm) <https://www.sparkfun.com/products/12993> (COM-12993) Used on SparkFun PicoBoard <https://www.sparkfun.com/products/11888> SMD-4.5MM - 4.5mm Square Trackball Switch Used on SparkFun Blackberry Trackballer Breakout <https://www.sparkfun.com/products/13169> SMD-4.6MMX2.8MM - 4.60mm x 2.80mm, surface mount Used on SparkFun SAMD21 Mini Breakout <https://www.sparkfun.com/products/13664> SMD-5.2MM, SMD-5.2-REDUNDANT - 5.2mm square, surface-mount Mini Pushbutton Switch - SMD <https://www.sparkfun.com/products/8720> (COM-08720) Used on Arduino Pro Mini <https://www.sparkfun.com/products/11114> REDUNDANT package connects both switch circuits together SMD-6.0X3.5MM - 6.0 x 3.5mm, surface mount Momentary Reset Switch SMD <https://www.sparkfun.com/products/8229> (COM-08229) SMD-6.2MM-TALL - 6.2mm square, surface mount Tactile Button - SMD (6mm) <https://www.sparkfun.com/products/12992> Used on SparkFun Digital Sandbox <https://www.sparkfun.com/products/12651> SMD-RIGHT-ANGLE - Right-angle, surface mount Used on SparkFun Block for Intel® Edison - Arduino <https://www.sparkfun.com/products/13036>; PROD_ID: SWCH-14139
U1 = SparkFun-IC-Power:MCP73831: MCP73831T Li-Ion, Li-Pol Controller Miniature single cell, fully integrated Li-Ion, Li-polymer charge management controller Datasheet <http://ww1.microchip.com/downloads/en/DeviceDoc/20001984g.pdf> SparkFun Products: SparkFun ESP32 Thing <https://www.sparkfun.com/products/13907> SparkFun 9DoF Razor IMU M0 <https://www.sparkfun.com/products/14001>; PROD_ID: IC-09995
U2 = SparkFun-IC-Power:V_REG_AP2112: AP2112 - 600mA CMOS LDO Regulator w/ Enable The AP2112 is CMOS process low dropout linear regulator with enable function, the regulator delivers a guaranteed 600mA (min.) continuous load current. Features Output Voltage Accuracy: ±1.5% Output Current: 600mA (Min.) Foldback Short Current Protection: 50mA Enable Function to Turn ON/OFF VOUT Low Dropout Voltage (3.3V): 250mV (Typ.) @IOUT=600mA Excellent Load Regulation: 0.2%/A (Typ.) Excellent Line Regulation: 0.02%/V (Typ.) Low Quiescent Current: 55μA (Typ.) Low Standby Current: 0.01μA (Typ.) Low Output Noise: 50μVRMS PSRR: 100Hz -65dB, 1kHz -65dB OTSD Protection Stable with 1.0μF Flexible Cap: Ceramic, Tantalum and Aluminum Electrolytic Operation Temperature Range: -40°C to 85°C ESD: MM 400V, HBM 4000V; PROD_ID: VREG-12457
U3 = SparkFun-GPS:U-BLOX_ZED-F9P; PROD_ID: IC-14209
U5 = SparkFun-RF:ESP-WROOM-32; PROD_ID: IC-13849
U6 = SparkFun-IC-Comms:CH340C; PROD_ID: IC-14038
U7 = SparkFun-IC-Power:MAX17048: Micropower 1-Cell Li+ ModelGauge SparkFun Products Qduino Mini <https://www.sparkfun.com/products/13614> (DEV-13614); PROD_ID: IC-12551

## Net classes
1 power: width 0.559 mm
2 3.3V: width 0.559 mm
3 RF: width 0.35 mm, clearance 0.203 mm

## Board
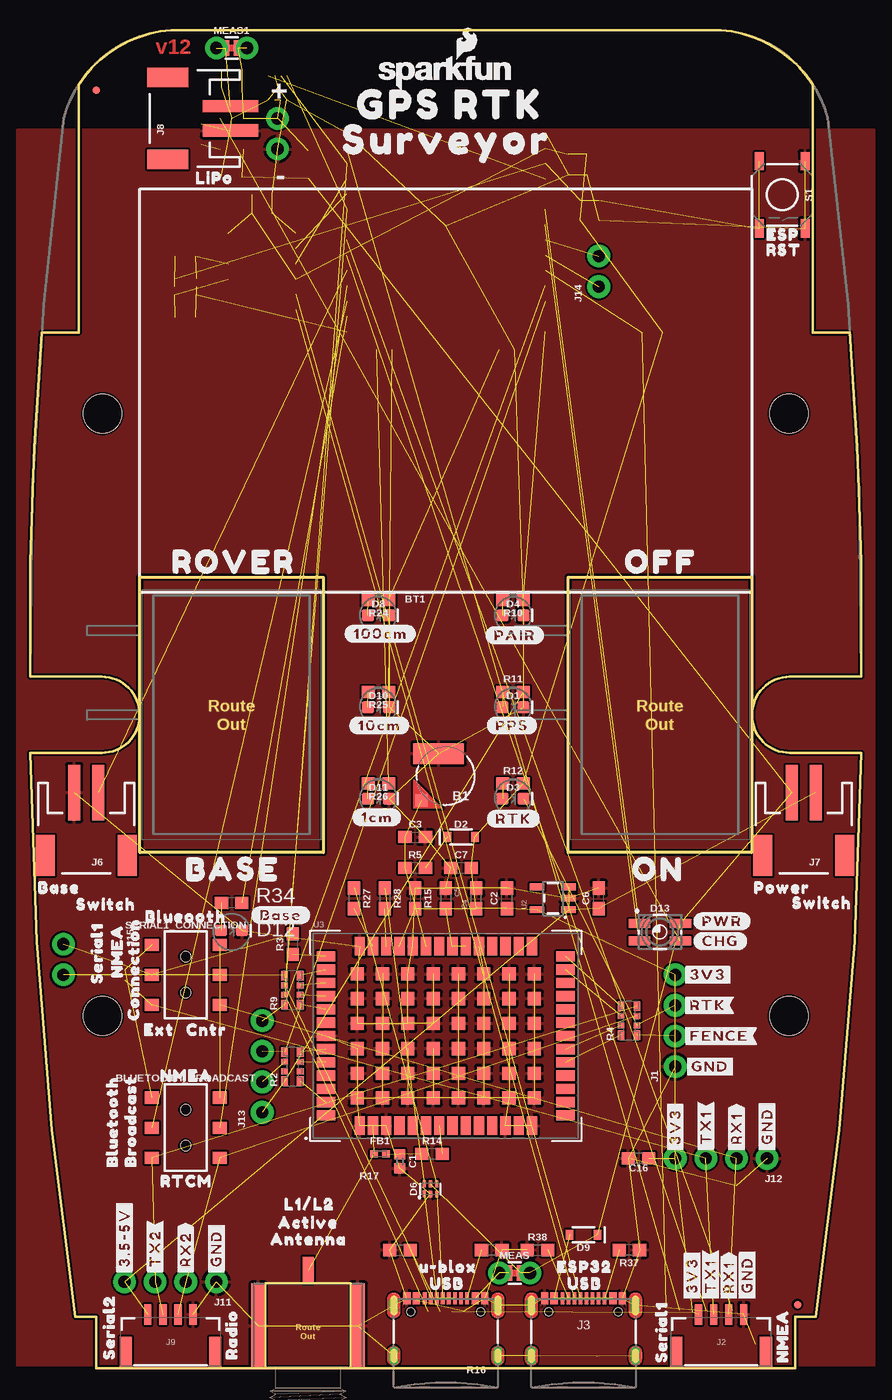
[diagram p1: board, top side]
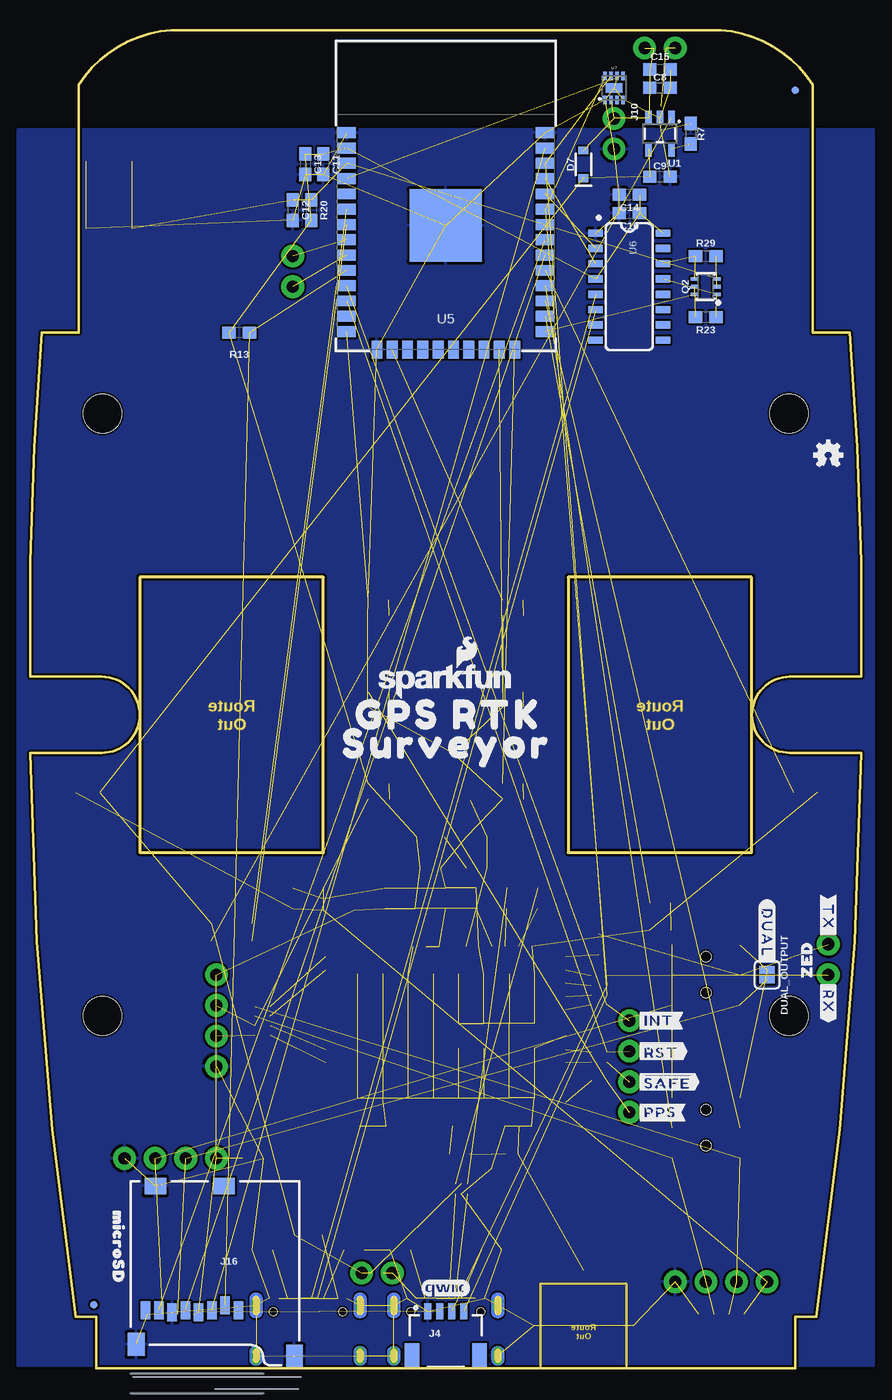
[diagram p2: board, bottom side, seen from below]

Size 69.02 x 111.14 mm. Coordinates in mm from the lower left corner, seen from the top.
Outline: 9.11,65.7 24.35,65.7 24.35,42.84 9.11,42.84 9.11,65.7
Outline: 44.67,65.7 59.91,65.7 59.91,42.84 44.67,42.84 44.67,65.7
Copper layers (1*2*15*16): Top 0.035559375mm / dielectric 0.47751875mm / Horz/GND 0.035559375mm / dielectric 0.47751875mm / Vert 0.035559375mm / dielectric 0.47751875mm / Bottom 0.035559375mm
Design rules "SparkFun-4-layer-TIGHT *": minimum track width 7mil, minimum drill 12mil, track to track 7mil, track to pad 7mil, pad to pad 7mil, via to via 7mil, smd to smd 7mil, copper to edge 7mil, drill to drill 7mil, minimum pad ring 7mil, minimum via ring 7mil, stop-mask expansion 4mil, vias tented up to drill 25mil, thermal gap 10mil

### Footprints (pad centres in the part's own frame; a part is rotated, then mirrored left to right if it is on the bottom)
ML414H_IV01E = smd 1 x 1: + 2.022,2.032 | smd 4.2 x 1.7: - 0.6,-1.85
SWITCH_DPDT_SMD_AYZ0202 = smd 1 x 1.15: 1 -2.5,2.825; 2 0,2.825; 3 2.5,2.825; 4 -2.5,-2.825; 5 0,-2.825; 6 2.5,-2.825 | hole 0.85: 1.5,0; -1.5,0
0402 = smd 0.85 x 0.9: 1 -0.58,0; 2 0.58,0
0603 = smd 1.1 x 1: 1 -0.85,0; 2 0.85,0
LED-0603 = smd 1 x 1: A -0.877,0; C 0.877,0
SOD-323 = smd 0.63 x 0.83: A 1.15,0; C -1.15,0
SOT886 = smd 0.61 x 0.25: 1 -0.405,0.5 | smd 0.56 x 0.25: 2 -0.43,0; 3 -0.43,-0.5; 4 0.43,-0.5; 5 0.43,0; 6 0.43,0.5
P-LCC-4-3 = smd 1.8 x 0.75: 1 -1.7,0.725; 2 -1.7,-0.725; 3 1.7,-0.725; 4 1.7,0.725
SMT-JUMPER_2_NO_SILK = smd 0.635 x 1.27: 1 -0.406,0; 2 0.406,0
SMA-EDGE-SMD = smd 1.15 x 7: GND@0 -4.14,-3.5; GND@1 4.14,-3.5 | smd 0.9 x 2.2: SIG 0,-8.1
0402-TIGHT = smd 0.6 x 0.6: 1 -0.5,0; 2 0.5,0
1X04_NO_SILK = drill 1.016 pad 1.88: 1 0,0; 2 2.54,0; 3 5.08,0; 4 7.62,0
JST-4-SMD-1.25MM-LOCKING = smd 0.6 x 1.7: 1 -1.875,3.3; 2 -0.625,3.3; 3 0.625,3.3; 4 1.875,3.3 | smd 1 x 2.7: NC1 3.725,0.1; NC2 -3.725,0.1
USB-C-16P-2LAYER-PADS = smd 0.3 x 1: A5 -1.25,-0.34; A6 -0.25,-0.34; A7 0.25,-0.34; A8 1.25,-0.34; B5 1.75,-0.34; B6 0.75,-0.34; B7 -0.75,-0.34; B8 -1.75,-0.34 | smd 0.6 x 1: GND -3.225,-0.34; GND2 3.225,-0.34; VBUS1 -2.45,-0.34; VBUS2 2.45,-0.34 | drill 0.4 pad 0.6 long: SHLD1 -4.318,-0.915; SHLD2 4.318,-0.915; SHLD3 -4.318,-5.095; SHLD4 4.318,-5.095 | hole 0.65: -2.89,-1.445; 2.89,-1.445
JST04_1MM_RA = smd 0.6 x 1.35: 1 -1.5,0; 2 -0.5,0; 3 0.5,0; 4 1.5,0 | smd 1.2 x 2: NC1 2.8,-3.675; NC2 -2.8,-3.675
JST-2-SMD = smd 1 x 4.6: 1 -1,-3.7; 2 1,-3.7 | smd 1.6 x 3.4: NC1 -3.4,1.5; NC2 3.4,1.5
1X02_NO_SILK = drill 1.016 pad 1.88: 1 0,0; 2 2.54,0
MICRO-SD-SOCKET = smd 1.8 x 1.4: CD1 -2.05,0.4; CD2 -7.75,0.4 | smd 0.8 x 1.5: CS/DAT3 -7.84,10.3; DAT1 -1.24,10.7; DAT2 -8.94,10.7; DI/CMD -6.74,10.7; DO/DAT0 -2.34,10.7; GND -3.44,10.9; SCLK -4.54,10.7; VCC -5.64,10.9 | smd 1.4 x 1.9: GND1 -13.6,14.55; GND3 -0.45,13.55
FIDUCIAL-MICRO = smd 0.635 x 0.635: 1 0,0
COMBO-JUMPER_2_NC_TRACE = smd 0.635 x 1.27: 1 -0.508,0; 2 0.508,0 | drill 1.016 pad 1.88: 3 -1.27,0; 4 1.27,0
SC70-6 = smd 0.3 x 0.66: 1 -0.65,-0.92; 2 0,-0.92; 3 0.65,-0.92; 4 0.65,0.92; 5 0,0.92; 6 -0.65,0.92
1206_RA = smd 0.8 x 0.55: P1 -1.2,-0.62; P4 1.2,-0.62; P5 1.2,0.68; P8 -1.2,0.68 | smd 0.5 x 0.55: P2 -0.4,-0.62; P3 0.4,-0.62; P6 0.4,0.68; P7 -0.4,0.68
TACTILE_SWITCH_SMD_5.2MM = smd 1.524 x 0.762: 1 -2.794,1.905; 2 2.794,1.905; 3 -2.794,-1.905; 4 2.794,-1.905
SOT23-5 = smd 0.55 x 1.2: 1 -0.95,-1.3; 2 0,-1.3; 3 0.95,-1.3; 4 0.95,1.3; 5 -0.95,1.3
ZED-F9P = smd 0.85 x 1.52: 1 -7.15,-7.45; 2 -6.05,-7.45; 3 -4.95,-7.45; 4 -3.85,-7.45; 5 -2.75,-7.45; 6 -1.65,-7.45; 7 -0.55,-7.45; 8 0.55,-7.45; 9 1.65,-7.45; 10 2.75,-7.45; 11 3.85,-7.45; 12 4.95,-7.45; 13 6.05,-7.45; 14 7.15,-7.45; 28 7.15,7.45; 29 6.05,7.45; 30 4.95,7.45; 31 3.85,7.45; 32 2.75,7.45; 33 1.65,7.45; 34 0.55,7.45; 35 -0.55,7.45; 36 -1.65,7.45; 37 -2.75,7.45; 38 -3.85,7.45; 39 -4.95,7.45; 40 -6.05,7.45; 41 -7.15,7.45 | smd 1.52 x 0.85: 15 9.95,-6.6; 16 9.95,-5.5; 17 9.95,-4.4; 18 9.95,-3.3; 19 9.95,-2.2; 20 9.95,-1.1; 21 9.95,0; 22 9.95,1.1; 23 9.95,2.2; 24 9.95,3.3; 25 9.95,4.4; 26 9.95,5.5; 27 9.95,6.6; 42 -9.95,6.6; 43 -9.95,5.5; 44 -9.95,4.4; 45 -9.95,3.3; 46 -9.95,2.2; 47 -9.95,1.1; 48 -9.95,0; 49 -9.95,-1.1; 50 -9.95,-2.2; 51 -9.95,-3.3; 52 -9.95,-4.4; 53 -9.95,-5.5; 54 -9.95,-6.6 | smd 1.1 x 1.1: 55 -1.05,-1.05; 56 -3.15,-1.05; 57 -5.25,-1.05; 58 -7.35,-1.05; 59 -1.05,-3.1; 60 -3.15,-3.1; 61 -5.25,-3.1; 62 -7.35,-3.1; 63 -1.05,-5.15; 64 -3.15,-5.15; 65 -5.25,-5.15; 66 -7.35,-5.15; 67 -1.05,5.15; 68 -3.15,5.15; 69 -5.25,5.15; 70 -7.35,5.15; 71 -1.05,3.1; 72 -3.15,3.1; 73 -5.25,3.1; 74 -7.35,3.1; 75 -1.05,1.05; 76 -3.15,1.05; 77 -5.25,1.05; 78 -7.35,1.05; 79 1.05,1.05; 80 3.15,1.05; 81 5.25,1.05; 82 7.35,1.05; 83 1.05,3.1; 84 3.15,3.1; 85 5.25,3.1; 86 7.35,3.1; 87 1.05,5.15; 88 3.15,5.15; 89 5.25,5.15; 90 7.35,5.15; 91 1.05,-5.15; 92 3.15,-5.15; 93 5.25,-5.15; 94 7.35,-5.15; 95 1.05,-3.1; 96 3.15,-3.1; 97 5.25,-3.1; 98 7.35,-3.1; 99 1.05,-1.05; 100 3.15,-1.05; 101 5.25,-1.05; 102 7.35,-1.05
ESP-WROOM-32-NARROW = smd 0.9 x 1.5: 1 6.43,8.238; 2 5.16,8.238; 3 3.89,8.238; 4 2.62,8.238; 5 1.35,8.238; 6 0.08,8.238; 7 -1.19,8.238; 8 -2.46,8.238; 9 -3.73,8.238; 10 -5,8.238; 11 -6.27,8.238; 12 -7.54,8.238; 13 -8.81,8.238; 14 -10.08,8.238; 25 -10.08,-8.238; 26 -8.81,-8.238; 27 -7.54,-8.238; 28 -6.27,-8.238; 29 -5,-8.238; 30 -3.73,-8.238; 31 -2.46,-8.238; 32 -1.19,-8.238; 33 0.08,-8.238; 34 1.35,-8.238; 35 2.62,-8.238; 36 3.89,-8.238; 37 5.16,-8.238; 38 6.43,-8.238 | smd 1.5 x 0.9: 15 -11.57,5.715; 16 -11.57,4.445; 17 -11.57,3.175; 18 -11.57,1.905; 19 -11.57,0.635; 20 -11.57,-0.635; 21 -11.57,-1.905; 22 -11.57,-3.175; 23 -11.57,-4.445; 24 -11.57,-5.715 | smd 6 x 6: GND -1.27,0
SO016 = smd 0.6 x 1.2: 1 -4.445,-2.8; 2 -3.175,-2.8; 3 -1.905,-2.8; 4 -0.635,-2.8; 5 0.635,-2.8; 6 1.905,-2.8; 7 3.175,-2.8; 8 4.445,-2.8; 9 4.445,2.8; 10 3.175,2.8; 11 1.905,2.8; 12 0.635,2.8; 13 -0.635,2.8; 14 -1.905,2.8; 15 -3.175,2.8; 16 -4.445,2.8
DFN-8 = smd 0.3 x 0.7: 1 -0.75,-0.99; 2 -0.25,-0.99; 3 0.25,-0.99; 4 0.75,-0.99; 5 0.75,0.99; 6 0.25,0.99; 7 -0.25,0.99; 8 -0.75,0.99 | smd 1.38 x 0.8: 9 0,0
1553DBK-ENCLOSURE = hole 3.2: -25.006,28.499; 25.006,28.499; 25.006,-28.499; -25.006,-28.499

### Placement (x,y rotation side)
B1  34.51,49.2 180 top
BLUETOOTH_BROADCAST  12.92,19.98 270 top
BT1  59.91,64.44 90 top
C1  30.7,17.19 270 top
C2  39.59,39.03 90 top
C3  31.97,44.11 0 top
C4  37.05,39.03 90 top
C5  34.51,39.03 270 top
C6  47.21,39.03 90 top
C7  35.78,41.58 0 top
C8  16.73,106.34 0 bottom
C9  16.73,98.98 0 bottom
C10  19.27,95.93 180 bottom
C11  44.67,100 270 bottom
C12  47.21,96.19 270 bottom
C13  46.19,100 270 bottom
C14  19.27,97.45 180 bottom
C15  16.73,107.87 0 bottom
C16  50.51,17.45 180 top
D1  40.1,54.91 0 top
D2  35.78,44.11 0 top
D3  40.1,47.29 0 top
D4  40.1,62.53 0 top
D6  33.24,14.91 90 top
D7  23.08,100 90 bottom
D8  28.92,62.53 0 top
D9  45.94,11.09 180 top
D10  28.92,54.91 0 top
D11  28.92,47.29 0 top
D12  16.73,36.37 0 top
D13  52.29,36.24 0 top
DUAL_OUTPUT  7.84,32.69 270 bottom
E1  23.08,0.05 180 top
FB1  29.05,17.83 0 top
J1  53.56,25.06 90 top
J2  57.37,1.19 0 top
J3  45.94,6.14 0 top
J4  34.51,4.74 0 bottom
J5  34.51,6.14 0 top
J6  4.66,44.11 180 top
J7  64.23,44.11 180 top
J8  12.92,103.81 90 top
J9  11.65,1.19 0 top
J10  20.54,103.81 270 bottom
J11  15.46,7.19 180 top
J12  61.18,17.45 180 top
J13  19.27,21.25 90 top
J14  47.21,89.84 90 top
J15  2.76,35.22 270 top
J16  60.67,15.54 180 bottom
JP21  63.72,5.28 0 top
JP61  5.48,106.16 0 top
JP71  63.72,5.28 0 bottom
JP81  5.48,106.16 0 bottom
LOGO1  2.76,75.86 0 bottom
LOGO2  34.51,57.07 0 bottom
LOGO3  SFE_LOGO_NAME_FLAME.1_INCH  [SFE_LOGO_NAME_FLAME_.1]  34.51,107.62 0 top
MEAS  40.22,7.92 0 top
MEAS1  16.73,109.65 0 top
Q2  12.92,89.84 90 bottom
R2  21.81,25.06 90 top
R3  21.81,35.22 90 top
R4  49.75,28.88 90 top
R5  31.97,41.58 0 top
R7  14.19,102.53 270 bottom
R9  21.81,31.41 90 top
R10  40.1,63.8 180 top
R11  40.1,56.18 0 top
R12  40.1,48.56 0 top
R13  51.65,86.03 180 bottom
R14  33.37,17.83 0 top
R15  31.97,39.03 270 top
R16  38.32,9.82 180 top
R17  30.7,9.82 0 top
R20  45.69,96.19 270 bottom
R23  12.92,87.3 180 bottom
R24  28.92,63.8 180 top
R25  28.92,56.18 180 top
R26  28.92,48.56 180 top
R27  26.89,39.03 270 top
R28  29.43,39.03 270 top
R29  12.92,92.38 0 bottom
R34  16.73,38.65 180 top
R37  49.75,9.82 180 top
R38  42.13,9.82 0 top
S1  62.45,97.45 270 top
SERIAL1_CONNECTION  12.92,32.69 270 top
U1  16.73,102.53 180 bottom
U2  43.4,39.03 90 top
U3  34.51,27.6 0 top
U5  34.51,96.19 90 bottom
U6  19.27,89.84 270 bottom
U7  20.54,106.34 0 bottom
U$1  [#GND#0]  54.19,25.06 0 top
U$3  [ROCKER_SWITCH]  16.73,54.27 90 top
U$4  [#BASE#0]  18.38,37.64 0 top
U$5  [#3V3#0]  53.56,17.86 90 top
U$6  [ANTENNA0]  19.27,10.71 0 top
U$7  [GPS_RTK0]  43.78,54.27 0 bottom
U$8  [#CHG#0]  55.08,35.48 0 top
U$9  [_SURVEYOR3]  45.69,51.86 0 bottom
U$10  [#RTK#1]  54.07,30.14 0 top
U$11  [#PPS#0]  18.76,21.25 0 bottom
U$12  [#RTK#0]  37.94,45.64 0 top
U$13  [LIGHT_PIPE_3MM]  52.28,36.22 0 top
U$14  [#RX#2]  2.76,32.18 270 bottom
U$15  [LIGHT_PIPE_3MM]  16.73,36.25 0 top
U$16  [ZED0]  4.54,31.8 90 bottom
U$17  [##SAFE##5]  18.76,23.79 0 bottom
U$18  [ACTIVE0]  19.9,12.11 0 top
U$19  [L1#L21]  20.41,13.63 0 top
U$20  [#PAIR#0]  37.81,60.88 0 top
U$21  [LIGHT_PIPE_3MM]  28.91,47.38 0 top
U$22  [BASE2]  11.52,41.45 0 top
U$23  [#3#5#5V#0]  7.84,7.7 90 top
U$24  [#PPS#1]  37.94,53.39 0 top
U$25  [#PWR#2]  55.08,37.13 0 top
U$26  [1553DBK-ENCLOSURE]  34.51,54.27 90 top
U$27  [LIPO0]  13.05,98.85 0 top
U$28  [##RST##4]  18.76,26.33 0 bottom
U$29  [SERIAL10]  52.42,-0.18 90 top
U$30  [QWIIC_4MM]  34.51,6.65 0 bottom
U$31  [OFF1]  47.97,66.97 0 top
U$32  [#FENCE#3]  54.07,27.6 0 top
U$33  [#INT#0]  18.76,28.88 0 bottom
U$34  [ROCKER_SWITCH]  52.29,54.27 90 top
U$35  [U#BLOX0]  31.59,8.43 0 top
U$36  [USB1]  32.48,7.03 0 top
U$37  [#3V3#0]  54.07,32.69 0 top
U$38  [#GND#0]  15.46,7.7 90 top
U$39  [#RX2#2]  12.92,7.7 90 top
U$40  [#TX2#1]  10.38,7.7 90 top
U$41  [BLUETOOTH2]  6.82,16.05 90 top
U$42  [ON0]  48.61,41.45 0 top
U$43  [SERIAL20]  6.57,0.08 90 top
U$44  [ROVER3]  10.38,66.97 0 top
U$45  [#RX1#2]  58,5.51 90 top
U$46  [#TX1#1]  56.48,5.51 90 top
U$47  [#3V3#0]  54.96,5.51 90 top
U$48  [#GND#0]  59.53,5.51 90 top
U$49  [NMEA1]  62.45,-0.18 90 top
U$50  [RADIO0]  16.73,0.08 90 top
U$51  [BROADCAST3]  8.35,16.05 90 top
U$52  [NMEA1]  10.13,24.3 0 top
U$53  [RTCM0]  10.13,15.54 0 top
U$54  [BASE0]  -0.03,39.92 0 top
U$55  [SWITCH1]  3.14,38.53 0 top
U$56  [POWER0]  59.4,39.92 0 top
U$57  [SWITCH1]  62.58,38.65 0 top
U$58  [BLUEOOTH3]  8.86,37.51 0 top
U$59  [CNTR1]  12.28,28.11 0 top
U$60  [RST1]  60.42,92.88 0 top
U$61  [EXT0]  8.73,28.11 0 top
U$62  [NMEA2]  7.2,31.8 90 top
U$63  [SERIAL10]  5.55,31.29 90 top
U$64  [CONNECTION1]  8.6,28.24 90 top
U$65  [#TX1#1]  56.1,17.86 90 top
U$66  [USB1]  43.91,7.03 0 top
U$67  [ESP320]  43.02,8.43 0 top
U$68  [#RX1#2]  58.64,17.86 90 top
U$69  [LIGHT_PIPE_3MM]  40.11,47.38 0 top
U$70  [GPS_RTK0]  25.37,104.95 0 top
U$71  [_SURVEYOR3]  23.33,102.03 0 top
U$72  [#TX#1]  2.76,39.29 270 bottom
U$73  [#DUAL#0]  7.84,38.91 270 bottom
U$74  [ESP0]  60.42,94.15 0 top
U$75  [LIGHT_PIPE_3MM]  40.11,54.98 0 top
U$76  [LIGHT_PIPE_3MM]  40.11,62.58 0 top
U$77  [LIGHT_PIPE_3MM]  28.91,62.58 0 top
U$78  [LIGHT_PIPE_3MM]  28.91,54.98 0 top
U$79  [#1CM#0]  26.76,45.77 0 top
U$80  [#10CM#1]  26.51,53.39 0 top
U$81  [#100CM#2]  26.13,61.01 0 top
U$82  [#GND#0]  61.18,17.86 90 top
U$83  [MICROSD0]  61.69,13.76 270 bottom

### Tracks (layer width: path | path; a pad name or v marks a point on that pad's centre or on a via)
3.3V  (25 unrouted)
5V  (5 unrouted)
ANT_VCC  (2 unrouted)
BACKUP  (3 unrouted)
CC1  (1 unrouted)
CC2  (1 unrouted)
CC3  (1 unrouted)
CC4  (1 unrouted)
CHG_LED  (1 unrouted)
D+  (1 unrouted)
D+1  (2 unrouted)
D-  (1 unrouted)
D-1  (2 unrouted)
ESP32_!DTR  (2 unrouted)
ESP32_!RTS  (2 unrouted)
ESP32_EN  (5 unrouted)
ESP32_RXI  (1 unrouted)
ESP32_TXO  (1 unrouted)
ESP_0/BOOT  (1 unrouted)
ESP_2/LED_1CM  (1 unrouted)
ESP_4/LED_BASE_STAT  (1 unrouted)
ESP_5/SWITCH_BASE_SELECT  (1 unrouted)
ESP_12/LED_BLUETOOTH  (1 unrouted)
ESP_13/LED_100CM  (1 unrouted)
ESP_15/LED_10CM  (1 unrouted)
ESP_16/BT_RXI  (1 unrouted)
ESP_17/BT_TXO  (1 unrouted)
ESP_18/SD_SCK  (1 unrouted)
ESP_19/SD_CIPO  (1 unrouted)
ESP_21/SDA  (3 unrouted)
ESP_22/SCL  (3 unrouted)
ESP_23/SD_COPI  (1 unrouted)
ESP_25/SD_!CS!  (2 unrouted)
ESP_26/ZED_TX_READY  (2 unrouted)
ESP_27/ZED_!RESET!  (2 unrouted)
ESP_32  (1 unrouted)
ESP_33  (1 unrouted)
ESP_34/PWR_LVL_RED  (1 unrouted)
ESP_35/PWR_LVL_GRN  (1 unrouted)
ESP_36/BATT_ALRT  (1 unrouted)
EXTERNAL_SERIAL1_RXI  (2 unrouted)
EXTERNAL_SERIAL1_TXO  (3 unrouted)
FENCE_LV  (1 unrouted)
GND  (125 unrouted)
  pour Top (isolate 0.152, rank 4): -1.05,102.91 70.07,102.91 70.07,0.2 -1.05,0.2
  pour Bottom (isolate 0.152, rank 4): -1.05,102.91 70.07,102.91 70.07,0.2 -1.05,0.2
GPS_ANT1  (2 unrouted)
N$1  (1 unrouted)
N$2  (1 unrouted)
N$3  (1 unrouted)
N$4  (3 unrouted)
N$5  (1 unrouted)
N$6  (1 unrouted)
N$7  (2 unrouted)
N$11  (1 unrouted)
N$12  (1 unrouted)
N$13  (1 unrouted)
N$16  (1 unrouted)
N$18  (1 unrouted)
N$22  (1 unrouted)
N$24  (1 unrouted)
N$25  (1 unrouted)
N$26  (1 unrouted)
N$27  (1 unrouted)
N$29  (1 unrouted)
N$30  (1 unrouted)
N$32  (2 unrouted)
NMEA-RX  (1 unrouted)
NMEA-TX  (2 unrouted)
PPS  (1 unrouted)
RTK_LV  (1 unrouted)
RX2_LV  (1 unrouted)
RXLV  (1 unrouted)
SCL_LV  (1 unrouted)
SDA_LV  (1 unrouted)
TX2_LV  (1 unrouted)
TXLV  (1 unrouted)
UNP_D+  (2 unrouted)
UNP_D-  (2 unrouted)
V_BATT  (8 unrouted)
VIN  (8 unrouted)
ZED-RXI1  (2 unrouted)
ZED-RXI2  (3 unrouted)
ZED-TXO1  (2 unrouted)
ZED-TXO2  (3 unrouted)
ZED_!SAFE!  (1 unrouted)
ZED_FENCE_STAT  (1 unrouted)
ZED_PPS_STAT  (2 unrouted)
ZED_RTK_STAT  (2 unrouted)

### Text on the board
Top: v12
Dimension: Route / Out | Route / Out
tPlace: + | -